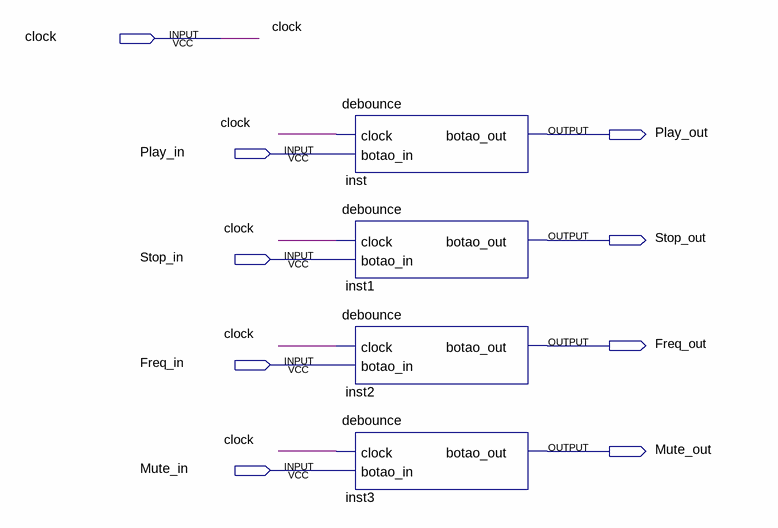
[diagram p0: schematic sheet]
// Quartus schematic debounce_bloco.bdf as structural Verilog: 4 symbols, 9 pins
module debounce_bloco (
  input  clock,
  input  Play_in,
  input  Stop_in,
  input  Freq_in,
  input  Mute_in,
  output Play_out,
  output Stop_out,
  output Freq_out,
  output Mute_out
);

  debounce inst (.clock(clock), .botao_in(Play_in), .botao_out(Play_out));
  debounce inst1 (.clock(clock), .botao_in(Stop_in), .botao_out(Stop_out));
  debounce inst2 (.clock(clock), .botao_in(Freq_in), .botao_out(Freq_out));
  debounce inst3 (.clock(clock), .botao_in(Mute_in), .botao_out(Mute_out));
endmodule
